# Altium schematic sheet Counter_of_area.SchDoc: Schematic
size A4; DrawnBy: Paweł K.
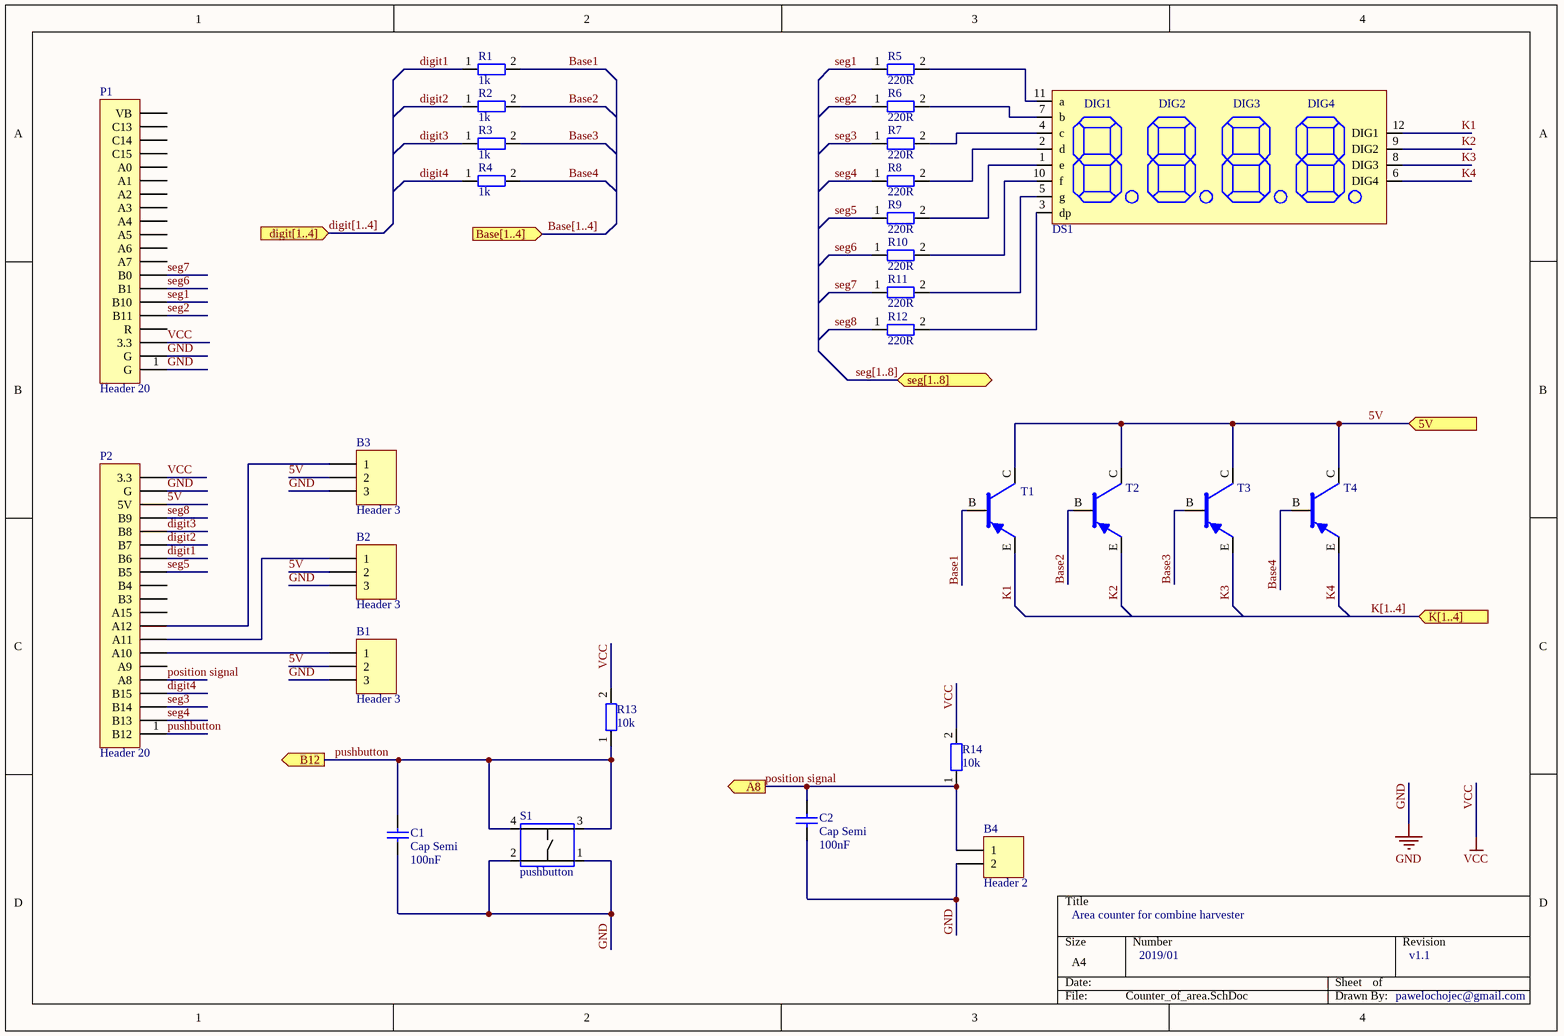
[diagram p0: Counter_of_area.SchDoc]

## Parts
B1  Header 3  [HDR1X3]
B2  Header 3  [HDR1X3]
B3  Header 3  [HDR1X3]
B4  Header 2  [HDR1X2]
C1  Cap Semi  value 100nF  [C1206]
C2  Cap Semi  value 100nF  [C1206]
DS1  KW4-561AGB  [7segment4digits]  (value not drawn)
P1  Header 20  [HDR1X20]
P2  Header 20  [HDR1X20]
R1  Resistance: 1k  [Resistor 1206]  (hidden comment: 1206 resistor)
R2  Resistance: 1k  [Resistor 1206]  (hidden comment: 1206 resistor)
R3  Resistance: 1k  [Resistor 1206]  (hidden comment: 1206 resistor)
R4  Resistance: 1k  [Resistor 1206]  (hidden comment: 1206 resistor)
R5  Resistance: 220R  [Resistor 1206]  (hidden comment: 1206 resistor)
R6  Resistance: 220R  [Resistor 1206]  (hidden comment: 1206 resistor)
R7  Resistance: 220R  [Resistor 1206]  (hidden comment: 1206 resistor)
R8  Resistance: 220R  [Resistor 1206]  (hidden comment: 1206 resistor)
R9  Resistance: 220R  [Resistor 1206]  (hidden comment: 1206 resistor)
R10  Resistance: 220R  [Resistor 1206]  (hidden comment: 1206 resistor)
R11  Resistance: 220R  [Resistor 1206]  (hidden comment: 1206 resistor)
R12  Resistance: 220R  [Resistor 1206]  (hidden comment: 1206 resistor)
R13  Resistance: 10k  [Resistor 1206]  (hidden comment: 1206 resistor)
R14  Resistance: 10k  [Resistor 1206]  (hidden comment: 1206 resistor)
S1  pushbutton  [TACT switch]
T1  BCX51-16.115  [SOT89-150P410X160-3M]  (value not drawn)
T2  BCX51-16.115  [SOT89-150P410X160-3M]  (value not drawn)
T3  BCX51-16.115  [SOT89-150P410X160-3M]  (value not drawn)
T4  BCX51-16.115  [SOT89-150P410X160-3M]  (value not drawn)

## Ports
5V (in), A8 (out), B12 (out), Base[1..4] (in), digit[1..4] (in), K[1..4] (in), seg[1..8] (bidir)

## Nets
GND: B1.3 B2.3 B3.3 B4.2 C1.1 C2.1 P1.1(G) P1.2(G) P2.19(G) S1.1 S1.2
VCC: P1.3(3.3) P2.20(3.3) R13.2 R14.2
5V: B1.2 B2.2 B3.2 P2.18(5V) T1.C T2.C T3.C T4.C ; port 5V
Base1: R1.2 T1.B
Base2: R2.2 T2.B
Base3: R3.2 T3.B
Base4: R4.2 T4.B
digit1: P2.14(B6) R1.1
digit2: P2.15(B7) R2.1
digit3: P2.16(B8) R3.1
digit4: P2.4(B15) R4.1
K1: DS1.12(DIG1) T1.E
K2: DS1.9(DIG2) T2.E
K3: DS1.8(DIG3) T3.E
K4: DS1.6(DIG4) T4.E
position signal: B4.1 C2.2 P2.5(A8) R14.1 ; port A8
pushbutton: C1.2 P2.1(B12) R13.1 S1.3 S1.4 ; port B12
seg1: P1.6(B10) R5.1
seg2: P1.5(B11) R6.1
seg3: P2.3(B14) R7.1
seg4: P2.2(B13) R8.1
seg5: P2.13(B5) R9.1
seg6: P1.7(B1) R10.1
seg7: P1.8(B0) R11.1
seg8: P2.17(B9) R12.1
NetB1_1: B1.1 P2.7(A10)
NetB2_1: B2.1 P2.8(A11)
NetB3_1: B3.1 P2.9(A12)
NetDS1_1: DS1.1(e) R9.2
NetDS1_2: DS1.2(d) R8.2
NetDS1_3: DS1.3(dp) R12.2
NetDS1_4: DS1.4(c) R7.2
NetDS1_5: DS1.5(g) R11.2
NetDS1_7: DS1.7(b) R6.2
NetDS1_10: DS1.10(f) R10.2
NetDS1_11: DS1.11(a) R5.2

Not connected (* = marked no-connect by the designer): P1 4(R) 9(A7) 10(A6) 11(A5) 12(A4) 13(A3) 14(A2) 15(A1) 16(A0) 17(C15) 18(C14) 19(C13) 20(VB); P2 6(A9) 10(A15) 11(B3) 12(B4)

## Buses and harness runs
bus Base[1..4] = port Base[1..4]
bus digit[1..4] = port digit[1..4]
bus K[1..4] = port K[1..4]
bus seg[1..8] = port seg[1..8]

## Notes on the sheet
- Area counter for combine harvester
- 2019/01
- v1.1
- pawelochojec@gmail.com
- Title
- Size:
- Date:
- A4
- Number:
- Time:
- Revision:
- Sheet
- of
- File:

## Library data of the parts
B1-B3 = Header 3: Header, 3-Pin; LatestRevisionDate: 17-Jul-2002; LatestRevisionNote: Re-released for DXP Platform.; Publisher: Altium Limited
B4 = Header 2: Header, 2-Pin; LatestRevisionDate: 17-Jul-2002; LatestRevisionNote: Re-released for DXP Platform.; Publisher: Altium Limited
C1 C2 = Cap Semi: Capacitor (Semiconductor SIM Model); Published: 8-Jun-2000; LatestRevisionDate: 29-May-2009; LatestRevisionNote: IPC-7351 Footprint Added.; PackageReference: C1206; Publisher: Altium Limited; PackageDescription: Chip Capacitor
DS1 = FYQ-5641AUHR-21: 7 segment, 4 digit display; Manufacturer: Foryard; Supplier 1: TME; Manufacturer Part Number: FYQ-5641AUHR-21; Stock 1: 641; Pricing 1: 1=1.32, 5=0.88, 35=0.73, 175=0.64, 630=0.59 (USD); Supplier Part Number 1: FYQ-5641AUHR-21
P1 P2 = Header 20: Header, 20-Pin; LatestRevisionDate: 17-Jul-2002; LatestRevisionNote: Re-released for DXP Platform.; Publisher: Altium Limited
R1-R14 = CRCW1206220RJNTABC: Resistor: thick film; SMD; 1206; 220O; 0.25W; ±5%; -55÷125°C; Manufacturer: Vishay; Power Rating: 250mW; Supplier 1: TME; Manufacturer Part Number: CRCW1206220RJNTABC; Stock 1: 277400; Pricing 1: 100=0.0314, 500=0.01833, 1000=0.01178, 5000=0.005, 15000=0.00487 (USD); Case/Package: 1206; Tolerance: 5%; Lead Free: Contains Lead; Supplier Part Number 1: CRCW1206220RJNTABC
S1 = B3F-1000: OMRON ELECTRONIC COMPONENTS         B3F-1000             Tactile Switch, Non Illuminated, 24 V, 50 mA, 0.98 N, Solder, B3F Series; Mechanical Life: 1000000Cycles; Max Voltage Rating (DC): 24V; Throw Configuration: SPST; Operating Force: 0.98N; Illumination Type: Non-Illuminated,Illuminated; Current Rating: 50mA; Switch Travel: 0.25mm; Switch Function: Off-Mom; Contact Resistance: 100mR; Number of Poles: 1; Actuator Type: Standard; Actuator Length: 0.9mm; Supplier 1: TME; Manufacturer: Omron; Manufacturer Part Number: B3F-1000; Stock 1: 6551; Pricing 1: 1=0.1397, 20=0.1319, 100=0.1241, 500=0.1186, 1000=0.11 (USD); Mount: Through Hole; Number of Pins: 4; Weight: 0.008818oz; Contact Plating: Gold; Contact Material: Gold,Silver; Min Operating Temperature: -25°C; Max Operating Temperature: 70°C; Package Quantity: 1500; Packaging: Bag; Voltage Rating (DC): 24V; Termination: PC Pins; Contact Current Rating: 50mA; Orientation: Straight; Max Current Rating: 50mA; Electrical Life: 1000000Cycles; Insulation Resistance: 100MR; Length: 6mm; Height: 3.4mm; Width: 6mm; Depth: 6mm; Lead Free: Lead Free; REACH SVHC: Unknown; ComponentLink1URL: http://www.farnell.com/datasheets/2082873.pdf?src-supplier=Newark; ComponentLink1Description: http://www.farnell.com/datasheets/2082873.pdf?src-supplier=Newark; ComponentLink2URL: http://www.farnell.com/datasheets/2082873.pdf?src-supplier=Element14; ComponentLink2Description: http://www.farnell.com/datasheets/2082873.pdf?src-supplier=Element14; ComponentLink3URL: https://omronfs.omron.com/en_US/ecb/products/pdf/en-b3f.pdf?src-supplier=Digi-Key; ComponentLink3Description: https://omronfs.omron.com/en_US/ecb/products/pdf/en-b3f.pdf?src-supplier=Digi-Key; ComponentLink4URL: https://www.distrelec.biz/Web/Downloads/he/et/B3F_eng_datasheet.pdf?mime=application%2Fpdf&src-supplier=Distrelec; ComponentLink4Description: https://www.distrelec.biz/Web/Downloads/he/et/B3F_eng_datasheet.pdf?mime=application%2Fpdf&src-supplier=Distrelec; ComponentLink5URL: http://www.onlinecomponents.com/productFiles/mf-OM/en-b3f.pdf?src-supplier=Onlinecomponents.com; ComponentLink5Description: http://www.onlinecomponents.com/productFiles/mf-OM/en-b3f.pdf?src-supplier=Onlinecomponents.com; ComponentLink6URL: http://www.mouser.com/ds/2/307/B3F_0811-26083.pdf?src-supplier=Mouser; ComponentLink6Description: http://www.mouser.com/ds/2/307/B3F_0811-26083.pdf?src-supplier=Mouser; ComponentLink7URL: http://www.jameco.com/Jameco/Products/ProdDS/162886.pdf?src-supplier=Jameco; ComponentLink7Description: http://www.jameco.com/Jameco/Products/ProdDS/162886.pdf?src-supplier=Jameco; ComponentLink8URL: https://www.alliedelec.com/m/d/0b4640ec13fd80eb1780b1c20343ca8a.pdf?src-supplier=Allied+Electronics; ComponentLink8Description: https://www.alliedelec.com/m/d/0b4640ec13fd80eb1780b1c20343ca8a.pdf?src-supplier=Allied+Electronics; ComponentLink9URL: https://www.verical.com/server-webapp/html/getDatasheet?partID=388862&src-supplier=Verical; ComponentLink9Description: https://www.verical.com/server-webapp/html/getDatasheet?partID=388862&src-supplier=Verical; ComponentLink10URL: http://www.rapidonline.com/pdf/78-0136.pdf?src-supplier=Rapid+Electronics; ComponentLink10Description: http://www.rapidonline.com/pdf/78-0136.pdf?src-supplier=Rapid+Electronics; Supplier Part Number 1: B3F-1000
T1-T4 = BCX51-16.115: TRANS PNP 400V 0.5A SOT89; Manufacturer: NXP Semiconductors; Manufacturer Part Number: BCX51-16115; Forward Voltage: 1.2V; ComponentLink1URL: https://www.diodes.com/assets/Datasheets/2DA1971.pdf?src-supplier=Digi-Key; ComponentLink1Description: https://www.diodes.com/assets/Datasheets/2DA1971.pdf?src-supplier=Digi-Key; ComponentLink2URL: https://www.verical.com/server-webapp/html/getDatasheet?partID=661243&src-supplier=Verical; ComponentLink2Description: https://www.verical.com/server-webapp/html/getDatasheet?partID=661243&src-supplier=Verical; ComponentLink3URL: http://www.mouser.com/ds/2/115/2DA1971-219201.pdf?src-supplier=Mouser; ComponentLink3Description: http://www.mouser.com/ds/2/115/2DA1971-219201.pdf?src-supplier=Mouser; Supplier 1: Mouser; Stock 1: 13194; Pricing 1: 1=0.4, 10=0.284, 50=0.284, 100=0.131, 1000=0.1, 2000=0.086, 10000=0.078, 25000=0.073, 50000=0.066, 100000=0.063 (USD); Number of Pins: 3; Polarity: PNP; Packaging: Tape and Reel; REACH SVHC: No SVHC; Lead Free: Lead Free; Supplier Part Number 1: 771-BCX51-16115